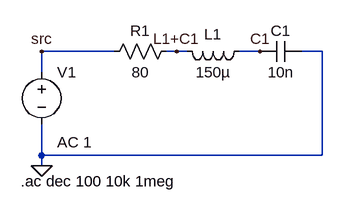
[diagram p0: schematic Draft3.asc]
Draft3.asc, the LTspice schematic file:
Version 4
SHEET 1 880 680
WIRE 128 128 16 128
WIRE 224 128 208 128
WIRE 240 128 224 128
WIRE 352 128 320 128
WIRE 448 128 416 128
WIRE 16 160 16 128
WIRE 16 288 16 240
WIRE 448 288 448 128
WIRE 448 288 16 288
WIRE 16 304 16 288
FLAG 16 304 0
FLAG 16 128 src
FLAG 224 128 L1+C1
FLAG 352 128 C1
SYMBOL res 224 112 R90
WINDOW 0 0 56 VBottom 2
WINDOW 3 32 56 VTop 2
SYMATTR InstName R1
SYMATTR Value 80
SYMBOL ind 336 112 R90
WINDOW 0 5 56 VBottom 2
WINDOW 3 32 56 VTop 2
SYMATTR InstName L1
SYMATTR Value 150µ
SYMBOL cap 416 112 R90
WINDOW 0 0 32 VBottom 2
WINDOW 3 32 32 VTop 2
SYMATTR InstName C1
SYMATTR Value 10n
SYMBOL voltage 16 144 R0
WINDOW 123 24 124 Left 2
WINDOW 39 0 0 Left 0
SYMATTR InstName V1
SYMATTR Value ""
SYMATTR Value2 AC 1
TEXT -16 328 Left 2 !.ac dec 100 10k 1meg

The netlist it stands for:
* Draft3.asc
R1 L1+C1 src 80
L1 C1 L1+C1 150µ
C1 0 C1 10n
V1 src 0 AC 1
.ac dec 100 10k 1meg
.backanno
.end

* Results of the author's LTspice run, read from the files saved beside the schematic
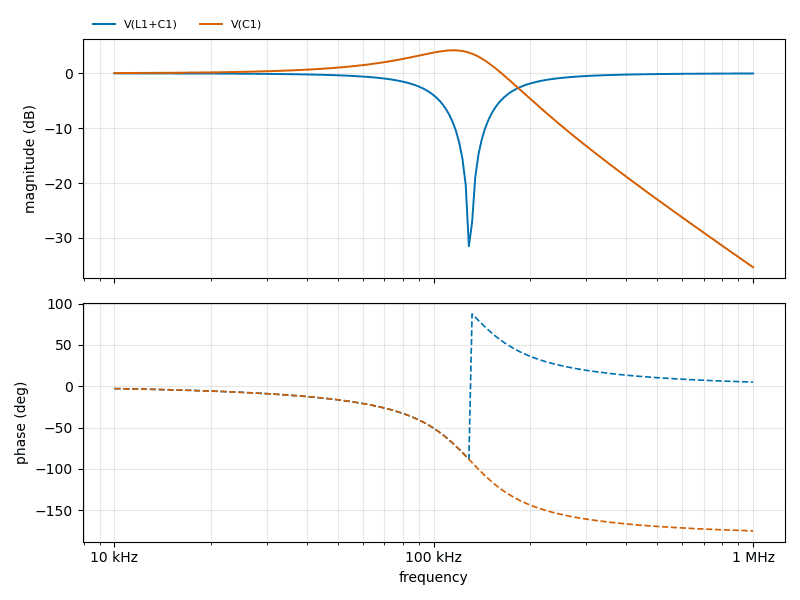
[diagram p1: AC Analysis of Draft3.asc, plotted from the saved traces]
* AC Analysis, 1 run:
*   V(L1+C1): -0.01 dB at 10 kHz, -0.03 dB at 1 MHz, peak -0.01 dB at 10 kHz, 3 dB below the peak at 94.3 kHz
*   V(C1): 0.04 dB at 10 kHz, -35.33 dB at 1 MHz, peak 4.19 dB at 114.8 kHz, 3 dB below the peak at 53.45 kHz and 154 kHz